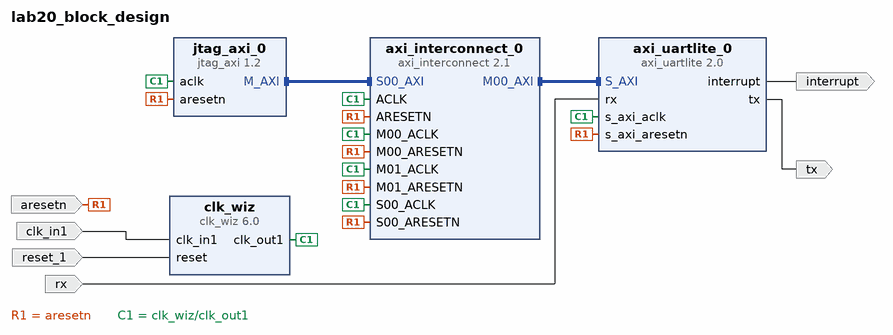
[diagram p0: block diagram of the top level]
# Vivado block design lab20_block_design, xc7a100tcsg324-1, Vivado 2024.2.1
create_bd_design lab20_block_design

create_bd_port -dir I -type clk clk_in1
set_property -dict {CONFIG.ASSOCIATED_RESET aresetn} [get_bd_ports clk_in1]
create_bd_port -dir I -type rst aresetn
set_property -dict {CONFIG.POLARITY ACTIVE_LOW} [get_bd_ports aresetn]
create_bd_port -dir I rx
create_bd_port -dir O tx
create_bd_port -dir O -type intr interrupt
create_bd_port -dir I -type rst reset_1
set_property -dict {CONFIG.POLARITY ACTIVE_HIGH} [get_bd_ports reset_1]

create_bd_cell -type ip -vlnv xilinx.com:ip:axi_uartlite:2.0 axi_uartlite_0
set_property -dict {CONFIG.UARTLITE_BOARD_INTERFACE usb_uart CONFIG.USE_BOARD_FLOW true} [get_bd_cells axi_uartlite_0]
create_bd_cell -type ip -vlnv xilinx.com:ip:jtag_axi:1.2 jtag_axi_0
set_property -dict {CONFIG.PROTOCOL 2} [get_bd_cells jtag_axi_0]
create_bd_cell -type ip -vlnv xilinx.com:ip:axi_interconnect:2.1 axi_interconnect_0
create_bd_cell -type ip -vlnv xilinx.com:ip:clk_wiz:6.0 clk_wiz
set_property -dict {CONFIG.CLKOUT1_REQUESTED_OUT_FREQ 100} [get_bd_cells clk_wiz]

# ---- connections ----

connect_bd_intf_net [get_bd_intf_pins axi_interconnect_0/M00_AXI] [get_bd_intf_pins axi_uartlite_0/S_AXI]
connect_bd_intf_net [get_bd_intf_pins jtag_axi_0/M_AXI] [get_bd_intf_pins axi_interconnect_0/S00_AXI]
connect_bd_net -net aresetn_0_1 [get_bd_ports aresetn] \
  [get_bd_pins jtag_axi_0/aresetn] [get_bd_pins axi_interconnect_0/S00_ARESETN] [get_bd_pins axi_interconnect_0/ARESETN] \
  [get_bd_pins axi_interconnect_0/M00_ARESETN] [get_bd_pins axi_interconnect_0/M01_ARESETN] \
  [get_bd_pins axi_uartlite_0/s_axi_aresetn]
connect_bd_net [get_bd_pins axi_uartlite_0/interrupt] [get_bd_ports interrupt]
connect_bd_net [get_bd_pins axi_uartlite_0/tx] [get_bd_ports tx]
connect_bd_net -net clk_in1_0_1 [get_bd_ports clk_in1] [get_bd_pins clk_wiz/clk_in1]
connect_bd_net [get_bd_pins clk_wiz/clk_out1] \
  [get_bd_pins axi_interconnect_0/ACLK] [get_bd_pins jtag_axi_0/aclk] [get_bd_pins axi_interconnect_0/S00_ACLK] \
  [get_bd_pins axi_uartlite_0/s_axi_aclk] [get_bd_pins axi_interconnect_0/M00_ACLK] [get_bd_pins axi_interconnect_0/M01_ACLK]
connect_bd_net -net reset_0_1 [get_bd_ports reset_1] [get_bd_pins clk_wiz/reset]
connect_bd_net -net rx_0_1 [get_bd_ports rx] [get_bd_pins axi_uartlite_0/rx]

# ---- address map ----
assign_bd_address -offset 0x40600000 -range 64K -target_address_space [get_bd_addr_spaces jtag_axi_0/Data] [get_bd_addr_segs axi_uartlite_0/S_AXI/Reg]

validate_bd_design
save_bd_design
